# Altium schematic sheet LNA.SchDoc: Low Noise Amplifier
size A3; Author: M.Beldyga; CompanyName: WUT ISE; DrawnBy: M.Beldyga; Organization: WUT ISE; Address1: PW ISE; Address2: Nowowiejska 15/19 00-665 Warsaw; Address3: micbeldyga@gmail.com; SheetNumber: 4; SheetTotal: 10; ModifiedBy: -; CheckedDate: -; DivGrp: WUT ISE; Designer: M.Beldyga; ModifiedDate: -; ProjectName: Sensor Box
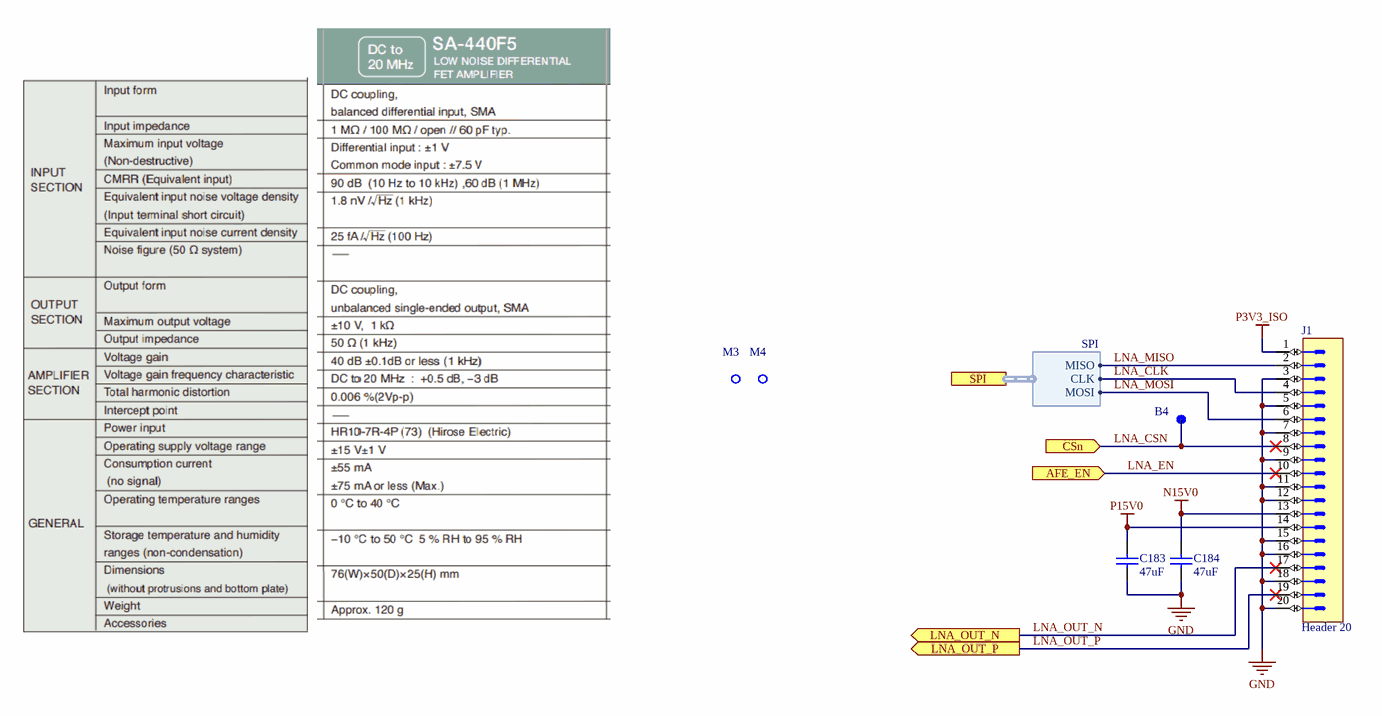
[diagram p0: LNA.SchDoc]

## Parts
B4  SMD Pad  [C100]  (value not drawn)  (no BOM)
C183  47uF  [CAPC3216X180N]
C184  47uF  [CAPC3216X180N]
J1  Header 20  [SAMTEC_HTSW-110-23-L-D]
M3  Plated Hole  [MTG300_600]  (value not drawn)  (no BOM)
M4  Plated Hole  [MTG300_600]  (value not drawn)  (no BOM)

## Ports
AFE_EN (in), CSn (in), LNA_OUT_N (out), LNA_OUT_P (out), SPI (harness SPI)

## Harnesses
SPI: CLK, MOSI, MISO

## Nets
GND: C183.2 C184.2 J1.3 J1.5 J1.7 J1.9 J1.11 J1.12 J1.15 J1.16 J1.18 J1.20
N15V0: C184.1 J1.13
P3V3_ISO: J1.1
P15V0: C183.1 J1.14
LNA_CLK: J1.4 ; port SPI.CLK
LNA_CSN: B4.1 J1.8 ; port CSn
LNA_EN: J1.10 ; port AFE_EN
LNA_MISO: J1.2 ; port SPI.MISO
LNA_MOSI: J1.6 ; port SPI.MOSI
LNA_OUT_N: J1.17 ; port LNA_OUT_N
LNA_OUT_P: J1.19 ; port LNA_OUT_P

Not connected (* = marked no-connect by the designer): M3 1; M4 1

## Notes on the sheet
- Project/Equipment
- Document
- Designer
- Drawn by
- Check.by
- Contact
- File
- Last Mod.
- Print Date
- Sheet
- Size
- A3
- of
- Rev

## Library data of the parts
B4 = SMD_PAD_D1MM: Pad; Part Description: 1mm Diameter SMD Pad; Mounted: No; Part Number: SMD_PAD_D1MM; Component Type: Standard (No BOM); Pin Count: 1; Family: SMD Pad; Socket: No; SMD: Yes; Sense: No; Status: None; ComponentHeight: 0mm; HelpURL: Undefined; Author: CERN DEM JLC; CreateDate: 10/10/2017; LatestRevisionDate: 10/10/2017; PackageDescription: 1mm Diameter SMD Pad
C183 C184 = CC1206_47UF_25V_20%_X5R: Non-polarised capacitor; Part Description: SMD Multilayer Chip Ceramic Capacitor; Manufacturer: TDK; Manufacturer Part Number: C3216X5R1E476M160AC; Voltage: 25V; TC: X5R; Tolerance: ±20%; Table: Capacitors SMD; Part Number: CC1206_47UF_25V_20%_X5R; Component Kind: Standard; Component Type: Standard; Pin Count: 2; Value: 47uF; Status: None; Case: 1206; Mounted: Yes; Socket: No; SMD: Yes; HelpURL: \\cern.ch\dfs\Applications\Altium\Datasheets\CC1206_X5R_TDK_C.pdf; Author: CERN DEM JLC; CreateDate: 2013-11-20; LatestRevisionDate: 2013-11-20; ComponentHeight: 1.8mm
J1 = SAMTEC_HTSW-110-23-L-D: Connector 20 Male; Part Description: 20 Contacts, Pitch 2.54mm, Dual Row Through Mount Straight Header (Post Lead 5.84mm, Tail Lead 2.92mm, Insulator 2.54mm); Manufacturer: SAMTEC; PressFit: No; Status Comment: High Temperature; Part Number: SAMTEC_HTSW-110-23-L-D; Component Kind: Standard; Component Type: Standard; Pin Count: 20; Family: Header 20; Mounted: Yes; Socket: No; SMD: No; Sense: No; Status: Preferred; Manufacturer Part Number: HTSW-110-23-L-D; ComponentHeight: 8.38mm; HelpURL: \\cern.ch\dfs\Applications\Altium\Datasheets\SAMTEC_HTSW-110-23-L-D.pdf; Author: CERN DEM JLC; CreateDate: 2/22/2018; LatestRevisionDate: 2/22/2018
M3 M4 = PLATED_HOLE3.0_PAD6.0: Single Terminal Socket; Part Description: Plated Through Hole: Hole Dia.=3.0mm Pad Dia.=6.0mm; Mounted: No; Table: Pads; Part Number: PLATED_HOLE3.0_PAD6.0; Component Type: Standard (No BOM); Designator: Single Terminal Socket; Library Reference: Single Terminal Socket; Pin Count: 1; Family: Plated Hole; Socket: No; SMD: No; Status: None; ComponentHeight: 0mm; Author: CERN DEM JLC; CreateDate: 26.05.2008; LatestRevisionDate: 26.05.2008; PackageDescription: Plated Through Hole: Hole Dia.=3.0mm Pad Dia.=6.0mm